# EAGLE design REV002 (EAGLE 7.7.0)
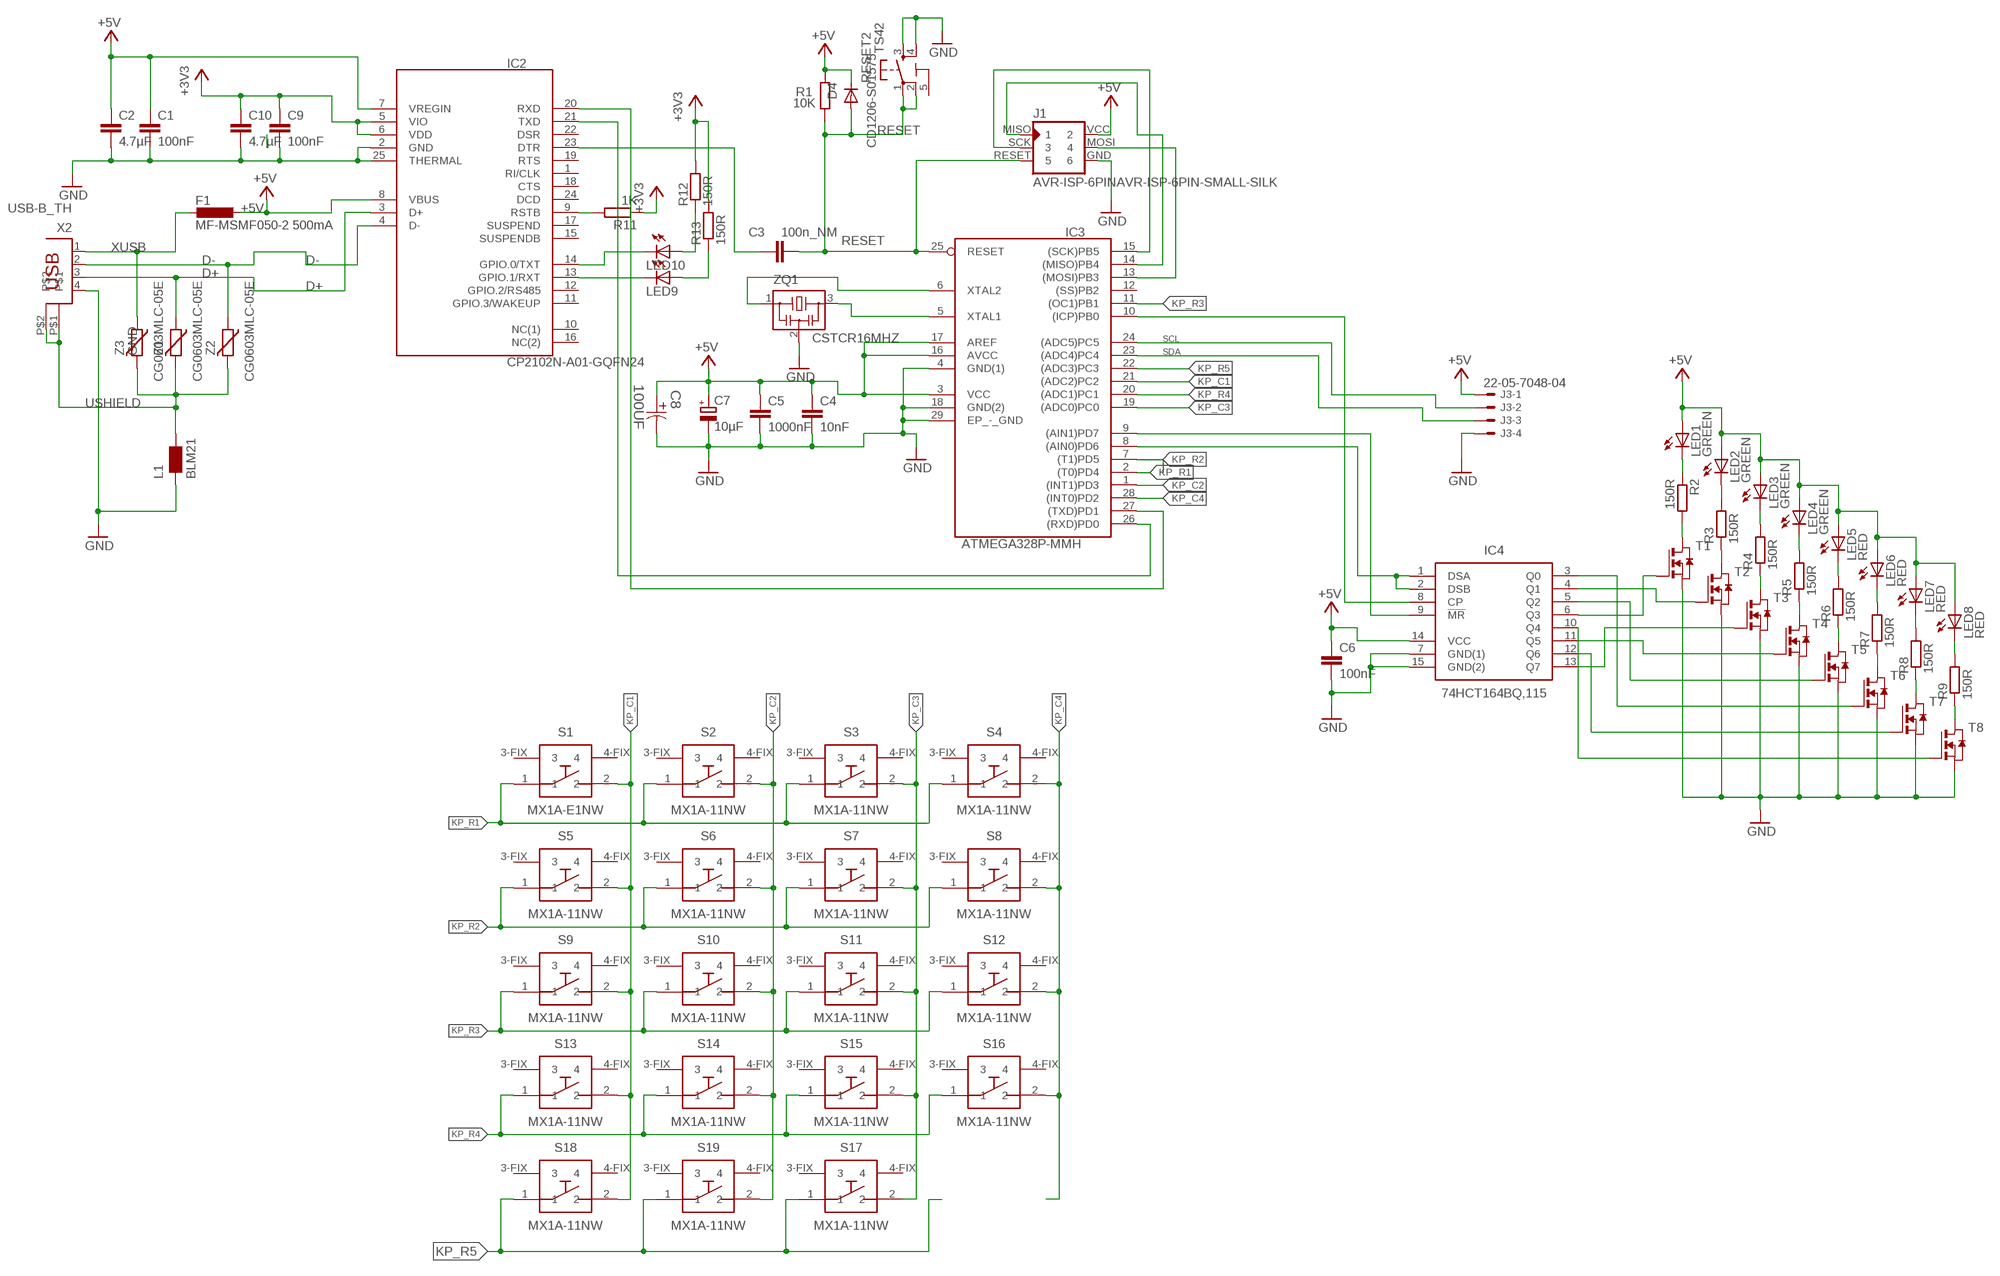
[diagram p0: schematic, sheet 1]

## Parts
C1  100nF  C-EUC0603K  [C0603K]
C2  4.7µF  C-EUC0603K  [C0603K]
C3  100n_NM  C-EUC0603K  [C0603K]
C4  10nF  C-EUC0603K  [C0603K]
C5  1000nF  C-EUC0603K  [C0603K]
C6  100nF  C-EUC0603K  [C0603K]
C7  10µF  CPOL-EUSMCB  [SMC_B]
C8  100UF  EEE-FT0J101AR-CASE-B  [CAPAE430X610N]
C9  100nF  C-EUC0603K  [C0603K]
C10  4.7µF  C-EUC0603K  [C0603K]
D4  CD1206-S01575  DIODE-MINIMELF  [MINIMELF]
F1  MF-MSMF050-2 500mA  L-EUL1812  [L1812]
IC2  CP2102N-A01-GQFN24  [QFN50P400X400X80-25N]
IC3  ATMEGA328P-MMH  [QFN45P400X400X100-29N]
IC4  74HCT164BQ,115  [QFN50P300X250X100-15N]
J1  AVR-ISP-6PINAVR-ISP-6PIN-SMALL-SILK  [AVR-ISP-6PIN-SMAILL-SILK]
J3  22-05-7048-04  [7395-04]
L1  BLM21  WE-CBF_0805  [0805]
LED1  GREEN  LEDP-LCC-2  [P-LCC-2]
LED2  GREEN  LEDP-LCC-2  [P-LCC-2]
LED3  GREEN  LEDP-LCC-2  [P-LCC-2]
LED4  GREEN  LEDP-LCC-2  [P-LCC-2]
LED5  RED  LEDP-LCC-2  [P-LCC-2]
LED6  RED  LEDP-LCC-2  [P-LCC-2]
LED7  RED  LEDP-LCC-2  [P-LCC-2]
LED8  RED  LEDP-LCC-2  [P-LCC-2]
LED9  LEDCHIPLED_0603  [CHIPLED_0603]
LED10  LEDCHIPLED_0603  [CHIPLED_0603]
R1  10K  R-EU_R0603  [R0603]
R2  150R  R-EU_R0603  [R0603]
R3  150R  R-EU_R0603  [R0603]
R4  150R  R-EU_R0603  [R0603]
R5  150R  R-EU_R0603  [R0603]
R6  150R  R-EU_R0603  [R0603]
R7  150R  R-EU_R0603  [R0603]
R8  150R  R-EU_R0603  [R0603]
R9  150R  R-EU_R0603  [R0603]
R11  1K  R-EU_R0603  [R0603]
R12  150R  R-EU_R0603  [R0603]
R13  150R  R-EU_R0603  [R0603]
RESET2  TS42  [TS42]
S1  MX1A-E1NW  MX1A-11NW  [MX1A-11NW_1]
S2  MX1A-11NW  [MX1A-11NW_1]
S3  MX1A-11NW  [MX1A-11NW_1]
S4  MX1A-11NW  [MX1A-11NW_1]
S5  MX1A-11NW  [MX1A-11NW_1]
S6  MX1A-11NW  [MX1A-11NW_1]
S7  MX1A-11NW  [MX1A-11NW_1]
S8  MX1A-11NW  [MX1A-11NW_1]
S9  MX1A-11NW  [MX1A-11NW_1]
S10  MX1A-11NW  [MX1A-11NW_1]
S11  MX1A-11NW  [MX1A-11NW_1]
S12  MX1A-11NW  [MX1A-11NW_1]
S13  MX1A-11NW  [MX1A-11NW_1]
S14  MX1A-11NW  [MX1A-11NW_1]
S15  MX1A-11NW  [MX1A-11NW_1]
S16  MX1A-11NW  [MX1A-11NW_1]
S17  MX1A-11NW  [MX1A-11NW_1]
S18  MX1A-11NW  [MX1A-11NW_1]
S19  MX1A-11NW  [MX1A-11NW_1]
T1  NMOSSOT23  [SOT-23]
T2  NMOSSOT23  [SOT-23]
T3  NMOSSOT23  [SOT-23]
T4  NMOSSOT23  [SOT-23]
T5  NMOSSOT23  [SOT-23]
T6  NMOSSOT23  [SOT-23]
T7  NMOSSOT23  [SOT-23]
T8  NMOSSOT23  [SOT-23]
X2  USB-B_TH  PN61729  [PN61729]
Z1  CG0603MLC-05E  VARISTORCN0603  [CT/CN0603]
Z2  CG0603MLC-05E  VARISTORCN0603  [CT/CN0603]
Z3  CG0603MLC-05E  VARISTORCN0603  [CT/CN0603]
ZQ1  CSTCR16MHZ  CSTCR  [CSTER12M]

## Nets
+3V3: C9.1 C10.1 IC2.5(VIO) IC2.6(VDD) R11.1 R12.2 R13.2
+5V: C1.1 C2.1 C4.1 C5.1 C6.1 C7.+ C8.1 D4.C F1.1 IC2.7(VREGIN) IC2.8(VBUS) IC3.3(VCC) IC3.16(AVCC) IC3.17(AREF) IC4.14(VCC) J1.VCC J3.1 LED1.A LED2.A LED3.A LED4.A LED5.A LED6.A LED7.A LED8.A R1.2
D+: IC2.3(D+) X2.3 Z1.1
D-: IC2.4(D-) X2.2 Z2.1
GND: C1.2 C2.2 C4.2 C5.2 C6.2 C7.- C8.2 C9.2 C10.2 IC2.2(GND) IC2.25(THERMAL) IC3.4(GND(1)) IC3.18(GND(2)) IC3.29(EP_-_GND) IC4.7(GND(1)) IC4.15(GND(2)) J1.GND J3.4 L1.1 RESET2.3 RESET2.4 T1.2(S) T2.2(S) T3.2(S) T4.2(S) T5.2(S) T6.2(S) T7.2(S) T8.2(S) X2.4 ZQ1.2
KP_C1: IC3.21((ADC2)PC2) S1.2 S5.2 S9.2 S13.2 S18.2
KP_C2: IC3.1((INT1)PD3) S2.2 S6.2 S10.2 S14.2 S19.2
KP_C3: IC3.19((ADC0)PC0) S3.2 S7.2 S11.2 S15.2 S17.2
KP_C4: IC3.28((INT0)PD2) S4.2 S8.2 S12.2 S16.2
KP_R1: IC3.2((T0)PD4) S1.1 S2.1 S3.1 S4.1
KP_R2: IC3.7((T1)PD5) S5.1 S6.1 S7.1 S8.1
KP_R3: IC3.11((OC1)PB1) S9.1 S10.1 S11.1 S12.1
KP_R4: IC3.20((ADC1)PC1) S13.1 S14.1 S15.1 S16.1
KP_R5: IC3.22((ADC3)PC3) S17.1 S18.1 S19.1
LED1-: LED1.C R2.1
LED2+: IC3.13((MOSI)PB3) J1.MOSI
LED3+: IC3.14((MISO)PB4) J1.MISO
LED4+: IC3.15((SCK)PB5) J1.SCK
N$1: IC4.6(Q3) T1.3(G)
N$2: IC2.9(RSTB) R11.2
N$3: C3.2 IC2.23(DTR)
N$4: IC2.14(GPIO.0/TXT) LED10.C
N$5: IC2.13(GPIO.1/RXT) LED9.C
N$6: LED10.A R12.1
N$7: LED9.A R13.1
N$8: IC4.4(Q1) T2.3(G)
N$9: R2.2 T1.1(D)
N$10: IC4.13(Q7) T3.3(G)
N$11: IC4.11(Q5) T4.3(G)
N$13: IC4.5(Q2) T5.3(G)
N$14: IC4.3(Q0) T6.3(G)
N$15: IC4.12(Q6) T7.3(G)
N$16: IC4.10(Q4) T8.3(G)
N$17: LED2.C R3.2
N$18: R3.1 T2.1(D)
N$19: R4.1 T3.1(D)
N$20: R5.1 T4.1(D)
N$21: R6.1 T5.1(D)
N$22: R7.1 T6.1(D)
N$23: R8.1 T7.1(D)
N$24: R9.1 T8.1(D)
N$25: LED8.C R9.2
N$26: LED7.C R8.2
N$27: LED6.C R7.2
N$28: LED5.C R6.2
N$29: LED4.C R5.2
N$30: LED3.C R4.2
N$31: IC3.10((ICP)PB0) IC4.8(CP)
N$32: IC3.8((AIN0)PD6) IC4.1(DSA) IC4.2(DSB)
N$33: IC3.9((AIN1)PD7) IC4.9(!MR)
RESET: C3.1 D4.A IC3.25(RESET) J1.RESET R1.1 RESET2.1 RESET2.2
RX: IC2.20(RXD) IC3.27((TXD)PD1)
SCL: IC3.24((ADC5)PC5) J3.2
SDA: IC3.23((ADC4)PC4) J3.3
TX: IC2.21(TXD) IC3.26((RXD)PD0)
USHIELD [gnd]: L1.2 X2.P$1 X2.P$2 Z1.2 Z2.2 Z3.2
XTAL1: IC3.5(XTAL1) ZQ1.3
XTAL2: IC3.6(XTAL2) ZQ1.1
XUSB [usbvcc]: F1.2 X2.1 Z3.1
Unconnected: IC2.1(RI/CLK) IC2.10(NC(1)) IC2.11(GPIO.3/WAKEUP) IC2.12(GPIO.2/RS485) IC2.15(SUSPENDB) IC2.16(NC(2)) IC2.17(SUSPEND) IC2.18(CTS) IC2.19(RTS) IC2.22(DSR) IC2.24(DCD) IC3.12((SS)PB2) S1.3-FIX S1.4-FIX S2.3-FIX S2.4-FIX S3.3-FIX S3.4-FIX S4.3-FIX S4.4-FIX S5.3-FIX S5.4-FIX S6.3-FIX S6.4-FIX S7.3-FIX S7.4-FIX S8.3-FIX S8.4-FIX S9.3-FIX S9.4-FIX S10.3-FIX S10.4-FIX S11.3-FIX S11.4-FIX S12.3-FIX S12.4-FIX S13.3-FIX S13.4-FIX S14.3-FIX S14.4-FIX S15.3-FIX S15.4-FIX S16.3-FIX S16.4-FIX S17.3-FIX S17.4-FIX S18.3-FIX S18.4-FIX S19.3-FIX S19.4-FIX

## Power pins joined to a net without a drawn wire
5-GND: RESET2.5(5-GND)

## Library data of the parts
C1 C2 C4-C6 C9 C10 = rcl:C-EU: CAPACITOR, European symbol
C3 = SmartPrj:C-EU: CAPACITOR, European symbol
C7 = rcl:CPOL-EU: POLARIZED CAPACITOR, European symbol
C8 = Panasonic-EEEFT_EEEH:EEE-: Aluminum Electrolytic Capacitors,Surface Mount Type; MPN: EEE-FT0J101AR; OC_FARNELL: 2065951; OC_NEWARK: 73T9146; PACKAGE: CASE-B; SUPPLIER: PANASONIC; TOLERANCE: ±20 %; VOLTAGERATING: 6.3V
D4 = diode:DIODE-: DIODE
F1 = rcl:L-EU: INDUCTOR, European symbol
IC2 = SamacSys_Parts:CP2102N-A01-GQFN24: SILICON LABS - CP2102N-A01-GQFN24 - USB-UART INTERFACE BRIDGE, QFN-24 <https://componentsearchengine.com/Images/1/CP2102N-A01-GQFN24.jpg> Source: Datasheet <http://www.farnell.com/datasheets/2245279.pdf>; DESCRIPTION: SILICON LABS - CP2102N-A01-GQFN24 - USB-UART INTERFACE BRIDGE, QFN-24; HEIGHT: 0.8mm; MANUFACTURER_NAME: Silicon Labs; MANUFACTURER_PART_NUMBER: CP2102N-A01-GQFN24
IC3 = SamacSys_Parts:ATMEGA328P-MMH: Atmel ATMEGA328P-MMH, 8bit AVR Microcontroller, 20MHz, 32 kB Flash, 28-Pin QFN <https://componentsearchengine.com/Images/3/ATMEGA328P-MMH.jpg> Source: Datasheet <http://uk.rs-online.com/web/p/products/8149138P>; DESCRIPTION: Atmel ATMEGA328P-MMH, 8bit AVR Microcontroller, 20MHz, 32 kB Flash, 28-Pin QFN; HEIGHT: 1mm; MANUFACTURER_NAME: Atmel; MANUFACTURER_PART_NUMBER: ATMEGA328P-MMH; RS_PART_NUMBER: 8149138P; SUPPLIER_NAME: RS
IC4 = SamacSys_Parts:74HCT164BQ,115: Counter Shift Registers 5V 8BIT S IN/P OUT <https://componentsearchengine.com/Images/1/74HCT164BQ%2C115.jpg> Source: Datasheet <http://www.mouser.com/ds/2/302/74HC_HCT164-839334.pdf>; DESCRIPTION: Counter Shift Registers 5V 8BIT S IN/P OUT; HEIGHT: mm; MANUFACTURER_NAME: NEXPERIA; MANUFACTURER_PART_NUMBER: 74HCT164BQ,115
J1 = avr-isb:AVR-ISP-6PIN: AVR ISP 6pin 3x2 pin header
J3 = con-molex:22-?-04: CONNECTOR wire to board 2.54 mm (.1 inch) pitch header; OC_FARNELL: unknown; OC_NEWARK: unknown
L1 = wuerth-elektronik:WE-CBF: SMD EMI Suppression Ferrite Beads - excellent anti-EMI properties - low DCR - impedances till 3000 ohms - rated current up to 6 A
LED1-LED8 = adafruit:LED: LED
LED9 LED10 = led:LED: LED
R1-R9 R11-R13 = rcl:R-EU_: RESISTOR, European symbol
RESET2 = SmartPrj:TS42: TS42 Dongnan Electronics Tact switch VDC 12V - 50mA
S1-S19 = SamacSys_Parts:MX1A-11NW: CHERRY AMERICAS - MX1A-11NW - SWITCH, TACTILE, SPST-NO, 0.01A, THT <https://componentsearchengine.com/Images/1/MX1A-11NW.jpg> Source: Datasheet <http://media.digikey.com/pdf/Data Sheets/Cherry PDFs/MX Series.pdf>; DESCRIPTION: CHERRY AMERICAS - MX1A-11NW - SWITCH, TACTILE, SPST-NO, 0.01A, THT; HEIGHT: mm; MANUFACTURER_NAME: CHERRY AMERICAS; MANUFACTURER_PART_NUMBER: MX1A-11NW
T1-T8 = zetex:NMOSSOT23: MOS FET; OC_FARNELL: unknown; OC_NEWARK: unknown
X2 = SmartPrj:PN61729: BERG USB connector
Z1-Z3 = varistor:VARISTOR: VARISTOR
ZQ1 = murata_reso:CSTC?: Resonator CSTCR �- 2.0 x 4.5 mm <http://search.murata.co.jp/Ceramy/CatalogAction.do?sHinnm=?&nbsp&sNHinnm=CSTCR6M00G53-R0&sNhin_key=CSTCR6M00G53-R0&sLang=en&sParam=CSTCR> CSTCE �- 1.3 x 3.2 mm <http://search.murata.co.jp/Ceramy/CatalogAction.do?sHinnm=?&nbsp&sNHinnm=CSTCE8M00G52-R0&sNhin_key=CSTCE8M00G52-R0&sLang=en&sParam=CSTCE>

## Net classes
1 power: width 0.152 mm, drill 0.61 mm, clearance 0.152 mm
2 gnd: width 0.305 mm, drill 0.559 mm, clearance 0.254 mm
3 usbvcc: width 0.508 mm, drill 0.61 mm, clearance 0.254 mm
4 aref: width 0.406 mm, drill 0.61 mm, clearance 0.254 mm

## Board
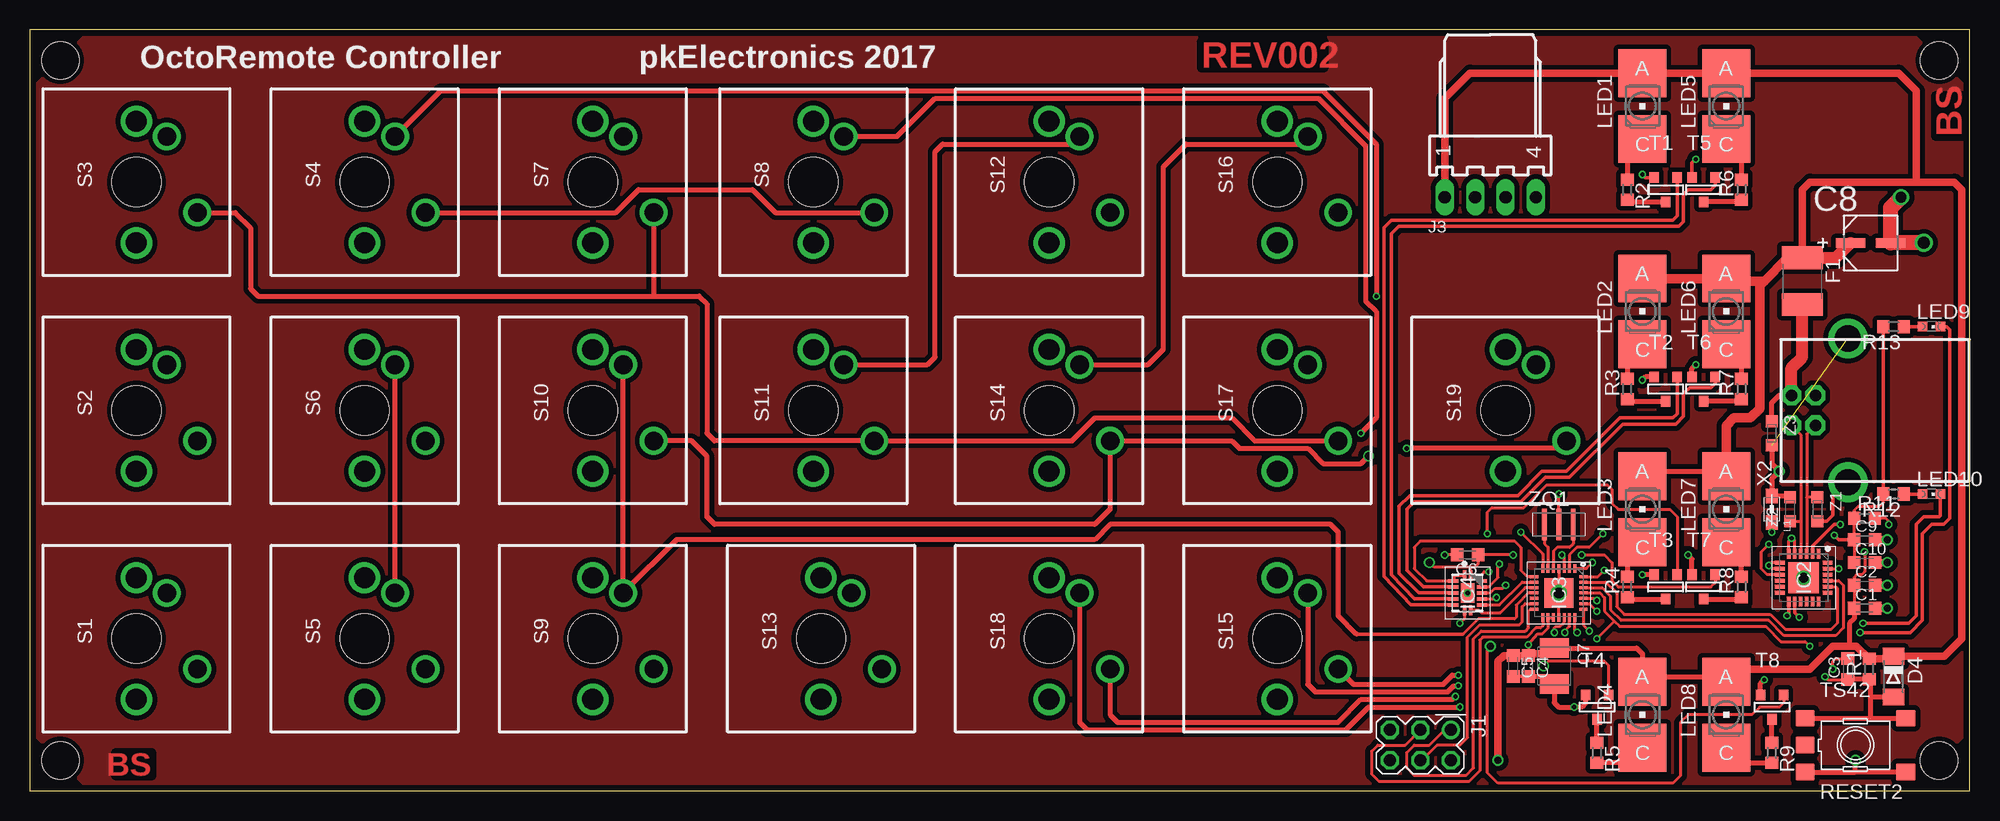
[diagram p1: board, top side]
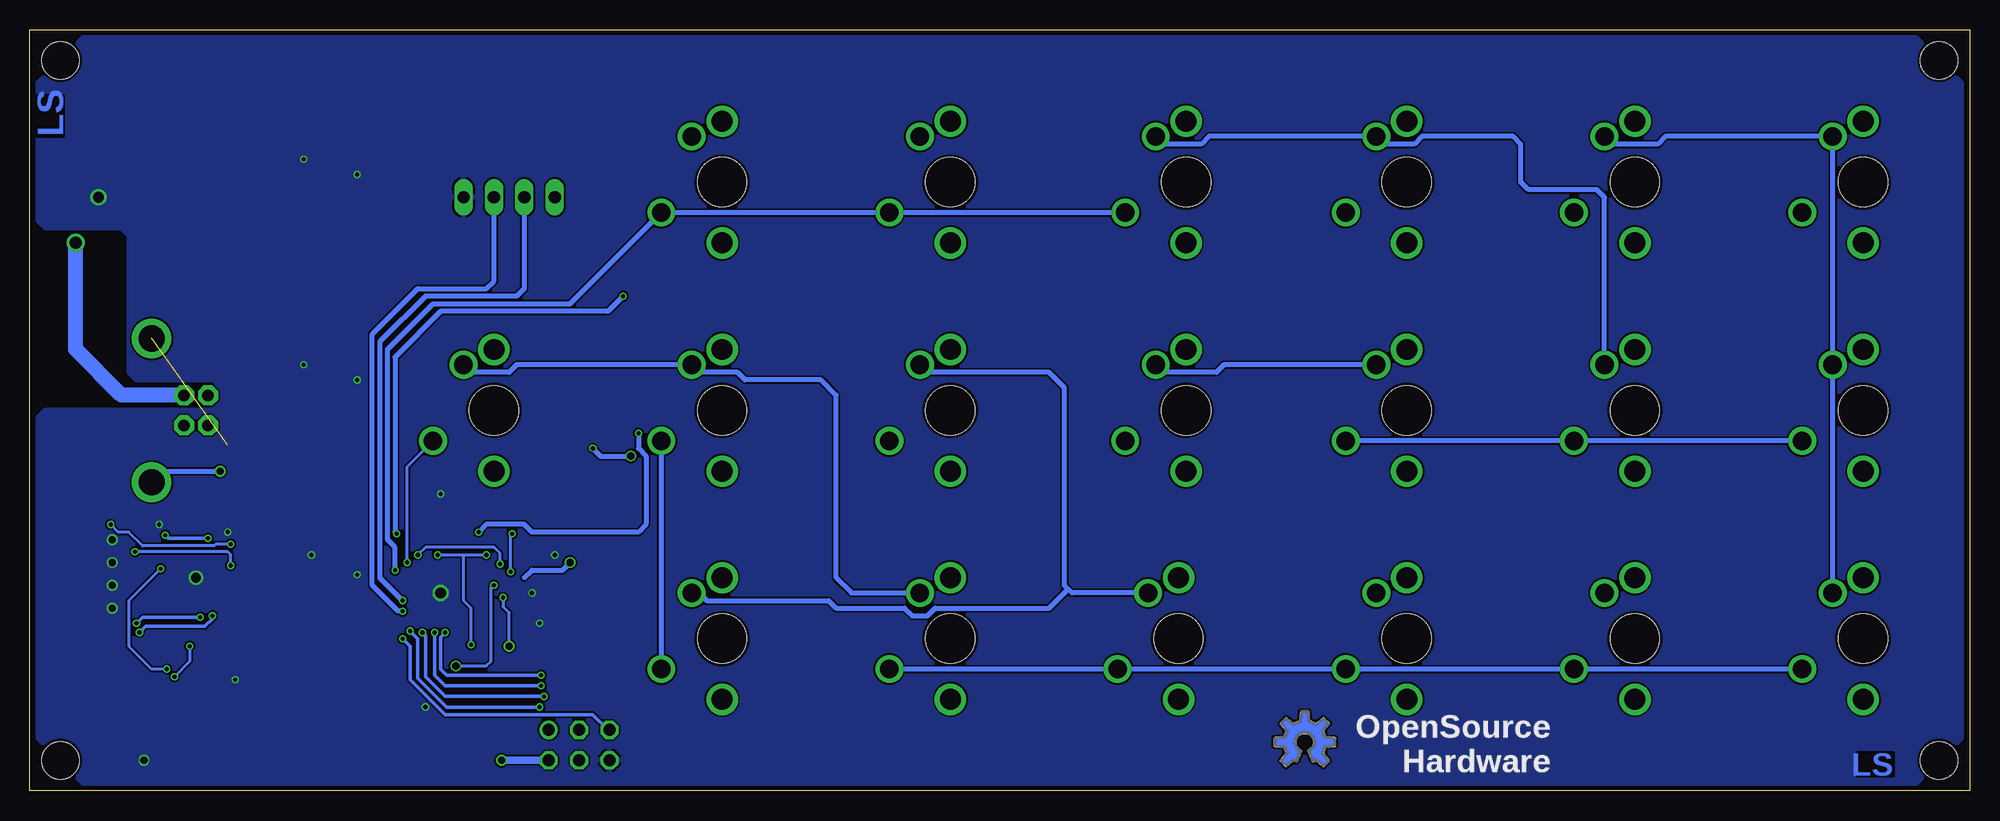
[diagram p2: board, bottom side, seen from below]

Size 161.93 x 63.5 mm. Coordinates in mm from the lower left corner, seen from the top.
Outline: 0,0 161.93,0 161.93,63.5 0,63.5 0,0
Copper layers (1*16): Top 0.018mm / dielectric 1.55mm / Bottom 0.018mm
Design rules "eC_2Layer_PClass6_BaseCopperO18_eCDefault": minimum track width 0.15mm, minimum drill 0.35mm, track to track 0.15mm, track to pad 0.15mm, pad to pad 0.15mm, via to via 0.15mm, smd to smd 0mil, copper to edge 0.25mm, drill to drill 0.35mm, minimum pad ring 0.175mm, minimum via ring 0.125mm, stop-mask expansion 0mil, vias tented up to drill 0.45mm, thermal gap 0.2mm
Holes 3.1 mm at 2.54,2.54 2.54,60.96 159.38,2.54 159.38,60.96

### Footprints (pad centres in the part's own frame; a part is rotated, then mirrored left to right if it is on the bottom)
C0603K = smd 1.05 x 1.08: 1 -0.875,0; 2 0.875,0
SMC_B = smd 1.6 x 2.4: + -1.5,0; - 1.5,0
CAPAE430X610N = smd 2.464 x 0.762: 1 -1.676,0; 2 1.676,0
MINIMELF = smd 1.4 x 1.8: A 1.7,0; C -1.7,0
L1812 = smd 1.9 x 3.4: 1 -1.95,0; 2 1.95,0
QFN50P400X400X80-25N = smd 0.8 x 0.3: 1 -2,1.25; 2 -2,0.75; 3 -2,0.25; 4 -2,-0.25; 5 -2,-0.75; 6 -2,-1.25; 13 2,-1.25; 14 2,-0.75; 15 2,-0.25; 16 2,0.25; 17 2,0.75; 18 2,1.25 | smd 0.3 x 0.8: 7 -1.25,-2; 8 -0.75,-2; 9 -0.25,-2; 10 0.25,-2; 11 0.75,-2; 12 1.25,-2; 19 1.25,2; 20 0.75,2; 21 0.25,2; 22 -0.25,2; 23 -0.75,2; 24 -1.25,2 | smd 2.55 x 2.55: 25 0,0
QFN45P400X400X100-29N = smd 0.7 x 0.25: 1 -2.05,1.35; 2 -2.05,0.9; 3 -2.05,0.45; 4 -2.05,0; 5 -2.05,-0.45; 6 -2.05,-0.9; 7 -2.05,-1.35; 15 2.05,-1.35; 16 2.05,-0.9; 17 2.05,-0.45; 18 2.05,0; 19 2.05,0.45; 20 2.05,0.9; 21 2.05,1.35 | smd 0.25 x 0.7: 8 -1.35,-2.05; 9 -0.9,-2.05; 10 -0.45,-2.05; 11 0,-2.05; 12 0.45,-2.05; 13 0.9,-2.05; 14 1.35,-2.05; 22 1.35,2.05; 23 0.9,2.05; 24 0.45,2.05; 25 0,2.05; 26 -0.45,2.05; 27 -0.9,2.05; 28 -1.35,2.05 | smd 2.45 x 2.45: 29 0,0
QFN50P300X250X100-15N = smd 0.85 x 0.3: 1 -1.45,-0.25; 7 1.45,-0.25; 8 1.45,0.25; 14 -1.45,0.25 | smd 0.3 x 0.85: 2 -1,-1.2; 3 -0.5,-1.2; 4 0,-1.2; 5 0.5,-1.2; 6 1,-1.2; 9 1,1.2; 10 0.5,1.2; 11 0,1.2; 12 -0.5,1.2; 13 -1,1.2 | smd 1.65 x 1.15: 15 0,0
AVR-ISP-6PIN-SMAILL-SILK = drill 1.016 octagon: GND 1.27,-2.54; MOSI 1.27,0; RESET -1.27,-2.54; SCK -1.27,0; VCC 1.27,2.54 | drill 1.016: MISO -1.27,2.54
7395-04 = drill 1.016 long: 1 3.81,0; 2 1.27,0; 3 -1.27,0; 4 -3.81,0
0805 = smd 1.2 x 1: 1 -1.1,0; 2 1.1,0
P-LCC-2 = smd 4 x 4: A 0,2.75; C 0,-2.75
CHIPLED_0603 = smd 0.8 x 0.8: A 0,-0.75; C 0,0.75
R0603 = smd 1 x 1.1: 1 -0.85,0; 2 0.85,0
TS42 = smd 1.6 x 1.4: 1 -4.2,2.25; 2 4.2,2.25; 3 -4.2,-2.25; 4 4.2,-2.25; 5 -4.2,0
MX1A-11NW_1 = drill 1.55: 1 -3.81,2.54; 2 2.54,5.08 | drill 1.75: 3-FIX -5.08,0; 4-FIX 5.08,0 | hole 4.1: 0,0
SOT-23 = smd 0.787 x 0.889: 1 0.025,-1.016; 2 -0.94,1.016; 3 0.991,1.016
PN61729 = drill 0.95 pad 1.676 octagon: 1 1.25,4.71; 2 -1.25,4.71; 3 -1.25,2.71; 4 1.25,2.71 | drill 2.2: P$1 -6,0; P$2 6,0
CT/CN0603 = smd 1 x 1: 1 -1,0; 2 1,0
CSTER12M = smd 0.4 x 2.6: 1 -1.2,0; 2 0,0; 3 1.2,0

### Placement (x,y rotation side)
C1  153.16,15.24 0 top
C2  153.16,17.14 0 top
C3  151.76,10.16 90 top
C4  125.09,10.41 270 top
C5  123.83,10.41 270 top
C6  120.02,19.68 180 top
C7  127.25,10.41 270 top
C8  153.67,45.72 0 top
C9  153.16,20.95 0 top
C10  153.16,19.05 0 top
D4  155.57,9.53 270 top
F1  147.96,42.55 270 top
IC2  148.08,17.78 270 top
IC3  127.64,16.51 270 top
IC4  120.02,16.51 270 top
J1  116.08,3.81 270 top
J3  121.92,49.53 180 top
L1  145.41,23.5 90 top
LED1  134.62,57.15 0 top
LED2  134.62,40.01 0 top
LED3  134.62,23.5 0 top
LED4  134.62,6.35 0 top
LED5  141.6,57.15 0 top
LED6  141.6,40.01 0 top
LED7  141.6,23.5 0 top
LED8  141.6,6.35 0 top
LED9  158.75,38.74 270 top
LED10  158.75,24.77 270 top
R1  153.54,10.16 90 top
R2  133.35,50.17 270 top
R3  133.35,33.53 90 top
R4  133.35,17.02 90 top
R5  130.81,3.17 270 top
R6  142.88,50.17 90 top
R7  142.88,33.53 90 top
R8  142.88,17.02 90 top
R9  145.41,3.17 270 top
R11  153.16,22.73 0 top
R12  155.57,24.77 180 top
R13  155.57,38.74 180 top
RESET2  152.4,3.81 0 top
S1  8.89,12.7 270 top
S2  8.89,31.75 270 top
S3  8.89,50.8 270 top
S4  27.94,50.8 270 top
S5  27.94,12.7 270 top
S6  27.94,31.75 270 top
S7  46.99,50.8 270 top
S8  65.41,50.8 270 top
S9  46.99,12.7 270 top
S10  46.99,31.75 270 top
S11  65.41,31.75 270 top
S12  85.09,50.8 270 top
S13  66.04,12.7 270 top
S14  85.09,31.75 270 top
S15  104.14,12.7 270 top
S16  104.14,50.8 270 top
S17  104.14,31.75 270 top
S18  85.09,12.7 270 top
S19  123.19,31.75 270 top
T1  136.53,50.17 0 top
T2  136.53,33.53 0 top
T3  136.53,17.02 0 top
T4  130.81,6.98 0 top
T5  139.7,50.17 0 top
T6  139.7,33.53 0 top
T7  139.7,17.02 0 top
T8  145.41,6.98 0 top
U$1  [OSHWLOGO_TOP_0.2]  55.5,4.06 0 bottom
X2  151.76,31.75 90 top
Z1  149.22,23.5 270 top
Z2  146.94,23.5 90 top
Z3  145.41,29.84 270 top
ZQ1  127.64,22.22 0 top

### Tracks (layer width: path | path; a pad name or v marks a point on that pad's centre or on a via)
+3V3  (via drill 0.35, 0.35 pad 0.25)
  Top 0.254: IC2.6 146.83,20.85 v147.07,21.08 147.19,21.08 147.33,20.94 IC2.5 | C10.1 C9.1 152.29,22.71 R11.1 152.31,23.41 152.65,23.75 154.43,23.75 154.72,24.04 R12.2
  Top 0.305: R13.2 R12.2 | v150.62,21.34 151,20.95 C9.1
  Bottom 0.305: v147.07,21.08 150.37,21.08 v150.62,21.34
+5V  (via drill 0.35, 0.6)
  Top 0.254: IC2.8 145.43,18.53 v145.16,18.8 145.4,19.03 IC2.7 | C1.1 C2.1 152.29,17.79 152.53,18.03 152.91,18.03 153.16,18.29 v153.16,19.94 | IC3.17 IC3.16 126.73,13.58 126.24,13.08 125.86,13.08 v125.09,12.19 C4.1 125.24,11.43 | C7.+ 126.85,11.91 126.36,11.43 | IC3.3 128.09,19.49 v127.89,19.68 | v123.83,19.68 C6.1 120.89,18.91 120.65,18.67 120.27,18.67 | v116.84,19.05 117.22,18.67 120.27,18.67 | IC4.14 120.27,18.67
  Top 0.406: 141.6,9.53 135.04,9.53 LED4.A 134.62,11.43 134.14,11.91 C7.+ | LED3.A 135.04,26.67 141.6,26.67 | C1.1 152.29,14.37 151.89,13.97 151.89,12.06 | LED6.A 141.6,42.55
  Top 0.61: LED8.A 141.6,9.53 142.24,10.16 148.59,10.16 150.5,12.06 151.89,12.06 152.49,12.06 R1.2 155.36,11.01 D4.C 159.81,11.22 161.29,12.7 161.29,50.17 160.66,50.8 157.48,50.8 | 146.69,44.45 147.96,44.45 147.96,50.17 148.59,50.8 157.48,50.8 | J3.1 118.11,57.79 120.22,59.9 LED1.A LED5.A 156,59.9 157.48,58.42 157.48,50.8 | v122.56,2.54 122.56,10.79 123.05,11.29 C5.1 C4.1 | 125.24,11.43 126.36,11.43
  Top 0.813: LED2.A 141.4,42.76 141.6,42.55 144.78,42.55 | 144.78,42.55 146.69,44.45 148.54,44.45 148.59,44.5 | LED7.A 141.6,26.67 141.6,30.48 142.24,31.11 143.64,31.11 144.4,31.88 144.4,42.16 144.78,42.55
  Top 1.016: F1.1 148.59,44.5 150.77,44.5 C8.1
  Bottom 0.254: v145.16,18.8 145.16,19.68 145.41,19.94 v153.16,19.94 | v127.89,19.68 125.73,19.68 | 125.73,19.68 v123.83,19.68 | v125.09,12.19 125.09,15.24 125.73,15.88 125.73,19.68
  Bottom 0.406: 120.65,17.78 120.02,18.41 117.47,18.41 v116.84,19.05
  Bottom 0.61: J1.VCC v122.56,2.54
D+
  Top 0.254: X2.3 148.33,29.78 148.33,24.5 | 148.33,24.5 IC2.3 | Z1.1 148.33,24.5
D-
  Top 0.254: X2.2 147.83,29.72 147.83,22.5 | 147.83,22.5 IC2.4 | Z2.1 147.83,22.5
GND  (via drill 0.35, 0.6, 0.8, 0.9, 1)
  Top 0.254: ZQ1.2 v127.64,24.77 | IC3.4 IC3.29 IC3.18 | C6.2 v118.11,19.68 | IC4.7 119.77,14.36 v119.38,13.97
  Top 0.305: T1.2 134.87,51.18 v134.62,51.44 | T5.2 138.76,52.4 v139.06,52.71 | C5.2 C4.2 | 145.41,22.22 v145.41,21.59 | IC2.2 148.83,20.43 150.62,22.22 v151.13,22.22
  Top 0.406: T3.2 v134.62,18.03 | T7.2 138.76,19.36 v138.43,19.68 | L1.1 145.41,22.22 | T8.2 144.47,8.97 v144.78,9.27 | T2.2 134.87,34.54 v134.62,34.29 | T6.2 138.76,35.26 v139.06,35.56 | C4.2 126.63,9.54 C7.- 127.25,7.37 127.64,6.98 v128.91,6.98 129.54,6.98 129.87,7.31 T4.2 | RESET2.3 152.4,1.56 | RESET2.4 152.4,1.56 | 152.4,1.56 v152.4,2.54
  Top 0.61: C9.2 v155.07,20.95 | C10.2 v155.07,19.05 | C2.2 v155.07,17.14 | C1.2 v155.07,15.24
  Top 1.27: v156.21,49.53 155.35,48.67 C8.2 v158.12,45.72
  Bottom 1.27: X2.4 149.07,33.02 154.31,33.02 158.12,36.83 v158.12,45.72
  other vias: 148.08,17.78 127.64,16.51 120.02,16.51
  pour Bottom: 161.29,4.45 157.48,0.64 4.45,0.64 0.64,4.45 0.64,59.05 4.45,62.87 157.48,62.87 161.29,59.05 161.29,47.62 160.66,46.99 154.31,46.99 153.67,46.36 153.67,34.93 153.03,34.29 146.69,34.29 146.05,33.66 146.05,32.38 146.69,31.75 160.66,31.75 161.29,31.11
KP_C1  (via drill 0.35)
  Top 0.254: v129.16,13.21 128.99,13.38 IC3.21
  Top 0.406: S18.2 90.17,6.35 90.81,5.71 109.22,5.71 111.12,7.62 118.75,7.62 v119,7.87
  Bottom 0.305: v119,7.87 127.25,7.87 128.91,9.53 128.91,12.95 v129.16,13.21
  Bottom 0.406: S1.2 S5.2 S9.2 S13.2 S18.2
KP_C2  (via drill 0.35, 0.6)
  Top 0.254: IC3.1 129.94,18.56 v130.43,19.05
  Top 0.406: S10.2 55.24,29.21 56.52,27.94 56.52,22.86 57.15,22.22 88.9,22.22 90.17,23.5 S14.2 100.33,29.21 100.97,28.57 106.68,28.57 107.95,27.3 111.12,27.3 v111.76,27.94 | S19.2 127.64,28.57 v114.94,28.57
  Bottom 0.254: v130.43,19.05 130.43,27.05 S19.2
  Bottom 0.406: S2.2 S6.2 S10.2 | v114.94,28.57 114.3,27.94 v111.76,27.94
KP_C3  (via drill 0.35)
  Top 0.254: v127.25,13.21 127.25,13.59 127.38,13.72 127.76,13.72 128.09,14.04 IC3.19
  Top 0.406: S3.2 17.14,48.26 18.41,46.99 18.41,41.91 19.05,41.28 52.07,41.28 | 52.07,41.28 55.88,41.28 56.52,40.64 56.52,29.84 57.15,29.21 S11.2 87,29.21 88.9,31.11 100.33,31.11 102.23,29.21 S17.2 | S15.2 110.49,8.89 117.98,8.89 118.75,9.65 v119.25,9.65 | S7.2 52.07,41.28
  Bottom 0.305: v119.25,9.65 127.13,9.65 127.64,10.16 127.64,12.83 v127.25,13.21
  Bottom 0.406: S17.2 S15.2
KP_C4  (via drill 0.35)
  Top 0.254: IC3.28 130.89,17.86 v131.44,18.41
  Top 0.406: S4.2 48.9,48.26 50.8,50.17 60.33,50.17 62.23,48.26 S8.2
  Bottom 0.406: S8.2 S12.2 S16.2 116.84,40.64 128.27,40.64 132.08,36.83 132.08,20.95 131.44,20.32 v131.44,18.41
KP_R1  (via drill 0.35)
  Top 0.254: v131.32,21.46 130.18,20.32 129.16,20.32 128.53,19.7 IC3.2
  Top 0.406: S4.1 34.29,58.42 107.95,58.42 112.39,53.98 v112.39,41.28
  Bottom 0.406: S1.1 S2.1 S3.1 25.4,54.61 26.04,53.98 29.84,53.98 S4.1 | v112.39,41.28 113.67,40.01 127.64,40.01 131.44,36.2 131.44,21.59 v131.32,21.46
KP_R2  (via drill 0.35)
  Top 0.254: v124.46,21.59 126.28,19.77 IC3.7
  Top 0.406: S5.1 S6.1 | S8.1 72.39,54.61 75.56,57.79 107.57,57.79 111.51,53.85 111.51,40.89 112.39,40.01 112.39,31.11 v111.12,29.84
  Bottom 0.406: S8.1 67.31,53.98 64.14,53.98 63.5,54.61 S7.1 48.9,53.98 46.35,53.98 45.72,54.61 38.1,54.61 37.47,53.98 37.47,50.8 36.83,50.17 31.11,50.17 30.48,49.53 S6.1 | v111.12,29.84 111.12,28.57 110.49,27.94 110.49,22.22 111.12,21.59 120.02,21.59 120.65,22.22 123.83,22.22 v124.46,21.59
KP_R3
  Top 0.254: IC3.11 125.09,16.51 124.08,15.49 124.08,14.48 123.95,14.35 120.9,14.35 119.63,13.08
  Top 0.305: 119.63,13.08 110.74,13.08
  Top 0.406: S10.1 S9.1 53.98,20.95 88.9,20.95 90.17,22.22 108.58,22.22 109.22,21.59 109.22,14.61 110.74,13.08 | S11.1 74.93,35.56 75.56,36.2 75.56,53.34 76.2,53.98 87,53.98 S12.1
  Bottom 0.406: S10.1 62.23,35.56 62.87,34.93 67.31,34.93 S11.1
KP_R4  (via drill 0.35)
  Top 0.254: v128.14,13.21 128.14,13.33 128.53,13.73 IC3.20
  Top 0.406: S15.1 106.68,8.89 107.31,8.26 118.36,8.26 118.87,8.76 v119.25,8.76 | S14.1 93.34,35.56 94.61,36.83 94.61,52.07 96.52,53.98 106.05,53.98 S16.1
  Bottom 0.305: v119.25,8.76 127.25,8.76 128.14,9.65 v128.14,13.21
  Bottom 0.406: S13.1 74.93,16.51 75.25,16.83 | 75.25,16.83 75.56,17.14 75.56,33.66 76.83,34.93 87,34.93 S14.1 | S15.1 106.05,16.51 105.41,15.88 95.25,15.88 94.61,15.24 88.9,15.24 88.27,14.61 87,14.61 86.36,15.24 76.83,15.24 75.25,16.83
KP_R5  (via drill 0.35)
  Top 0.254: IC3.22 129.69,13.82 v130.18,13.33
  Top 0.406: S18.1 87.63,5.71 88.27,5.08 109.86,5.08 111.76,6.98 v119.38,6.98
  Bottom 0.305: v119.38,6.98 127.13,6.98 129.54,9.4 129.54,12.7 v130.18,13.33
  Bottom 0.406: S19.1 125.09,34.93 121.92,34.93 121.28,35.56 S17.1 106.05,34.93 102.87,34.93 102.23,34.29 95.89,34.29 94.61,33.02 94.61,17.78 93.34,16.51 S18.1
LED1-
  Top 0.406: LED1.C 133.35,53.13 R2.1
LED2+
  Top 0.254: J1.MOSI 116.2,2.54 117.47,3.81 119.38,3.81 120.02,4.45 120.02,12.83 121.03,13.84 124.33,13.84 124.59,14.1 124.59,15.37 124.83,15.61 IC3.13
LED3+
  Top 0.254: J1.MISO 118.11,5.08 116.84,3.81 115.57,3.81 114.94,3.17 114.94,1.91 115.57,1.27 119.89,1.27 120.52,1.91 120.52,12.7 121.16,13.33 124.84,13.33 125.09,13.59 125.09,14.99 125.27,15.16 IC3.14
LED4+
  Top 0.254: J1.SCK 114.81,3.81 112.52,3.81 112.01,3.3 112.01,1.4 112.65,0.76 120.14,0.76 121.03,1.65 121.03,12.57 121.28,12.83 124.97,12.83 125.73,13.59 126.11,13.59 126.28,13.76 IC3.15
N$1
  Top 0.305: T1.3 137.52,47.98 137.16,47.62 113.67,47.62 113.03,46.99 113.03,17.91 115.3,15.51 IC4.6
N$2  (via drill 0.35)
  Top 0.254: IC2.9 145.04,18.03 144.53,18.54 144.53,19.94 v145.16,20.57 | v155.19,22.22 155.19,22.48 154.94,22.73 R11.2
  Bottom 0.254: v145.16,20.57 146.43,20.57 146.56,20.45 152.53,20.45 153.67,21.59 154.56,21.59 v155.19,22.22
N$3  (via drill 0.35)
  Top 0.254: IC2.23 v151.01,18.53 | v150.5,10.16 150.5,10.79 150.74,11.04 C3.2
  Bottom 0.254: v151.01,18.53 153.67,15.88 153.67,12.06 151.76,10.16 v150.5,10.16
N$4  (via drill 0.35)
  Top 0.305: IC2.14 147.33,14.85 v147.7,14.48 | v153.03,13.97 156.84,13.97 157.48,14.61 157.48,22.22 158.12,22.86 159.38,22.86 159.5,22.97 LED10.C
  Bottom 0.305: v147.7,14.48 152.53,14.48 v153.03,13.97
N$5  (via drill 0.35)
  Top 0.305: IC2.13 146.83,14.75 v146.69,14.61 | v152.78,13.21 156.97,13.21 157.99,14.22 157.99,21.46 158.75,22.22 159.77,22.22 160.27,22.73 160.27,38.48 160.02,38.74 LED9.C
  Bottom 0.305: v152.78,13.21 152.27,13.72 147.32,13.72 146.69,14.35 v146.69,14.61
N$6
  Top 0.305: LED10.A R12.1
N$7
  Top 0.305: LED9.A R13.1 156.21,38.74
N$8
  Top 0.305: T2.3 137.52,31.47 137.16,31.11 132.72,31.11 128.27,26.67 126.24,26.67 124.21,24.64 115.19,24.64 114.3,23.75 114.3,18.16 115.95,16.51 IC4.4
N$9
  Top 0.406: R2.2 133.52,49.15 T1.1
N$10  (via drill 0.35)
  Top 0.254: IC4.13 121.22,18.09 121.41,18.29 v121.79,18.29 | v121.67,21.46 121.67,23.24 122.05,23.62 124.71,23.62 126.62,25.53 131.7,25.53 132.08,25.15 132.08,24 132.59,23.5 136.91,23.5 137.52,22.88 T3.3
  Bottom 0.254: v121.79,18.29 121.79,21.34 v121.67,21.46
N$11  (via drill 0.35, 0.6)
  Top 0.254: T4.3 131.8,10.44 131.44,10.79 126.75,10.79 v126.36,10.41 | IC4.11 121.92,16.51 122.3,16.89 122.94,16.89 v123.19,17.14
  Bottom 0.254: v126.36,10.41 123.83,10.41 123.44,10.79 123.44,17.02 123.32,17.14 v123.19,17.14
N$12
  pour Top (isolate 0.406): 0.64,4.45 4.45,0.64 157.48,0.64 161.29,4.45 161.29,59.05 157.48,62.87 4.45,62.87 0.64,59.05
N$13
  Top 0.305: T5.3 140.69,50.52 140.34,50.17 138.43,50.17 138.05,49.78 138.05,47.5 137.67,47.12 114.3,47.12 113.67,46.48 113.67,18.03 115.56,16.01 IC4.5
N$14
  Top 0.305: T6.3 140.69,34.01 140.34,33.66 138.56,33.66 138.05,33.15 138.05,31.24 137.41,30.61 132.97,30.61 128.52,26.16 126.49,26.16 124.46,24.13 115.57,24.13 114.94,23.5 114.94,18.41 116.34,17.01 IC4.3
N$15  (via drill 0.35)
  Top 0.254: T7.3 140.69,17.37 140.34,17.02 132.59,17.02 132.08,17.53 132.08,19.05 131.44,19.68 v129.54,19.68 | IC4.12 121.78,17.01 122.56,17.78 122.56,18.8 v122.68,18.92
  Bottom 0.254: v122.68,18.92 122.68,19.81 123.19,20.32 128.91,20.32 v129.54,19.68
N$16  (via drill 0.35, 0.6)
  Top 0.254: T8.3 146.41,7.34 146.05,6.98 144.4,6.98 143.76,6.35 138.43,6.35 137.79,5.71 137.79,1.27 137.16,0.64 122.56,0.64 121.67,1.52 121.67,11.81 v121.92,12.06 | IC4.10 122.31,16.01 v122.43,16.13
  Bottom 0.254: v121.92,12.06 121.92,14.86 122.43,15.37 v122.43,16.13
N$17
  Top 0.406: LED2.C 133.35,35.99 R3.2
N$18
  Top 0.406: R3.1 133.52,32.51 T2.1
N$19
  Top 0.406: R4.1 133.52,16 T3.1
N$20
  Top 0.406: R5.1 130.81,5.97 T4.1
N$21
  Top 0.406: R6.1 142.71,49.15 T5.1
N$22
  Top 0.406: R7.1 142.71,32.51 T6.1
N$23
  Top 0.406: T7.1 142.71,16 arc90 R8.1
N$24
  Top 0.406: R9.1 145.41,5.97 T8.1
N$25
  Top 0.406: LED8.C 141.6,2.33 R9.2
N$26
  Top 0.406: R8.2 142.88,19.47 arc90 LED7.C
N$27
  Top 0.406: LED6.C 142.88,35.99 R7.2
N$28
  Top 0.406: LED5.C 142.88,53.13 R6.2
N$29
  Top 0.406: LED4.C 134.62,2.33 R5.2
N$30
  Top 0.406: LED3.C 133.35,20.75 R4.2
N$31
  Top 0.254: IC3.10 124.84,16.96 122.74,14.86 121.16,14.86 120.96,15.06 IC4.8
N$32
  Top 0.254: IC3.8 125.02,17.86 124.46,18.41 124.46,20.32 123.95,20.83 116.08,20.83 115.57,20.32 115.57,18.54 116.6,17.51 IC4.2 118.87,17.57 118.87,17.78 119.05,17.96 IC4.1
N$33
  Top 0.254: IC4.9 122.69,15.51 124.59,17.41 IC3.9
RESET  (via drill 0.35)
  Top 0.254: IC3.25 131.06,16.51 131.44,16.13 131.44,14.99 132.27,14.16 | v148.59,12.06 148.21,12.45 146.18,12.45 144.91,13.72 132.72,13.72 132.27,14.16 | v149.86,9.53 150.1,9.29 C3.1 | v130.81,12.7 132.27,14.16
  Top 0.406: 153.67,6.06 153.67,7.82 | D4.A 153.67,7.82 | 153.67,7.82 153.67,9.18 R1.1 151.76,9.31 C3.1 | RESET2.1 153.67,6.06 | 153.67,6.06 RESET2.2
  Bottom 0.254: v148.59,12.06 148.59,10.79 v149.86,9.53
  Bottom 0.305: 113.67,5.08 114.94,6.35 127.25,6.35 130.18,9.27 130.18,12.06 v130.81,12.7
  Bottom 0.406: 113.67,5.08 J1.RESET
RX
  Top 0.254: IC2.20 150.74,17.03 150.88,16.89 150.88,13.97 150.37,13.46 146.56,13.46 145.29,14.73 133.1,14.73 132.46,15.37 132.46,16.51 131.56,17.41 IC3.27
SCL  (via drill 0.35)
  Top 0.254: IC3.24 130.62,16.06 v130.81,15.88
  Bottom 0.406: J3.2 120.65,41.91 121.28,41.28 128.91,41.28 132.72,37.47 132.72,17.78 v130.81,15.88
SDA  (via drill 0.35)
  Top 0.254: IC3.23 130.19,15.61 v130.81,14.99
  Bottom 0.406: v130.81,14.99 131.19,14.99 133.35,17.14 133.35,38.1 129.54,41.91 123.83,41.91 123.19,42.55 J3.3
TX
  Top 0.254: IC2.21 151,17.53 151.38,17.14 151.38,13.59 150.75,12.95 146.43,12.95 145.16,14.22 132.84,14.22 131.95,15.11 131.95,16.26 131.25,16.96 IC3.26
USHIELD  (via drill 0.6)  (1 unrouted)
  Top 0.305: Z1.2 150,22.5 150.5,22.99 150.5,24.48 X2.P$1
  Top 0.406: Z2.2 146.84,24.59 L1.2 145.41,26.04 v146.05,26.67 145.41,27.3 Z3.2
  Bottom 0.406: X2.P$1 150.84,26.67 v146.05,26.67
XTAL1
  Top 0.254: ZQ1.3 128.84,20.63 128.52,20.32 127.51,20.32 127.19,20 IC3.5
XTAL2
  Top 0.254: ZQ1.1 126.44,20.63 126.73,20.33 IC3.6
XUSB
  Top 0.406: Z3.1 145.41,32.38 146.05,33.02 147.03,33.02 X2.1
  Top 1.016: X2.1 147.06,35.3 147.96,36.2 F1.2

### Text on the board
Top: REV002 | BS | BS
Bottom: LS | LS
tPlace: OctoRemote Controller | pkElectronics 2017
bPlace: OpenSource / Hardware